# EAGLE design Power Supply (EAGLE 9.2.2)
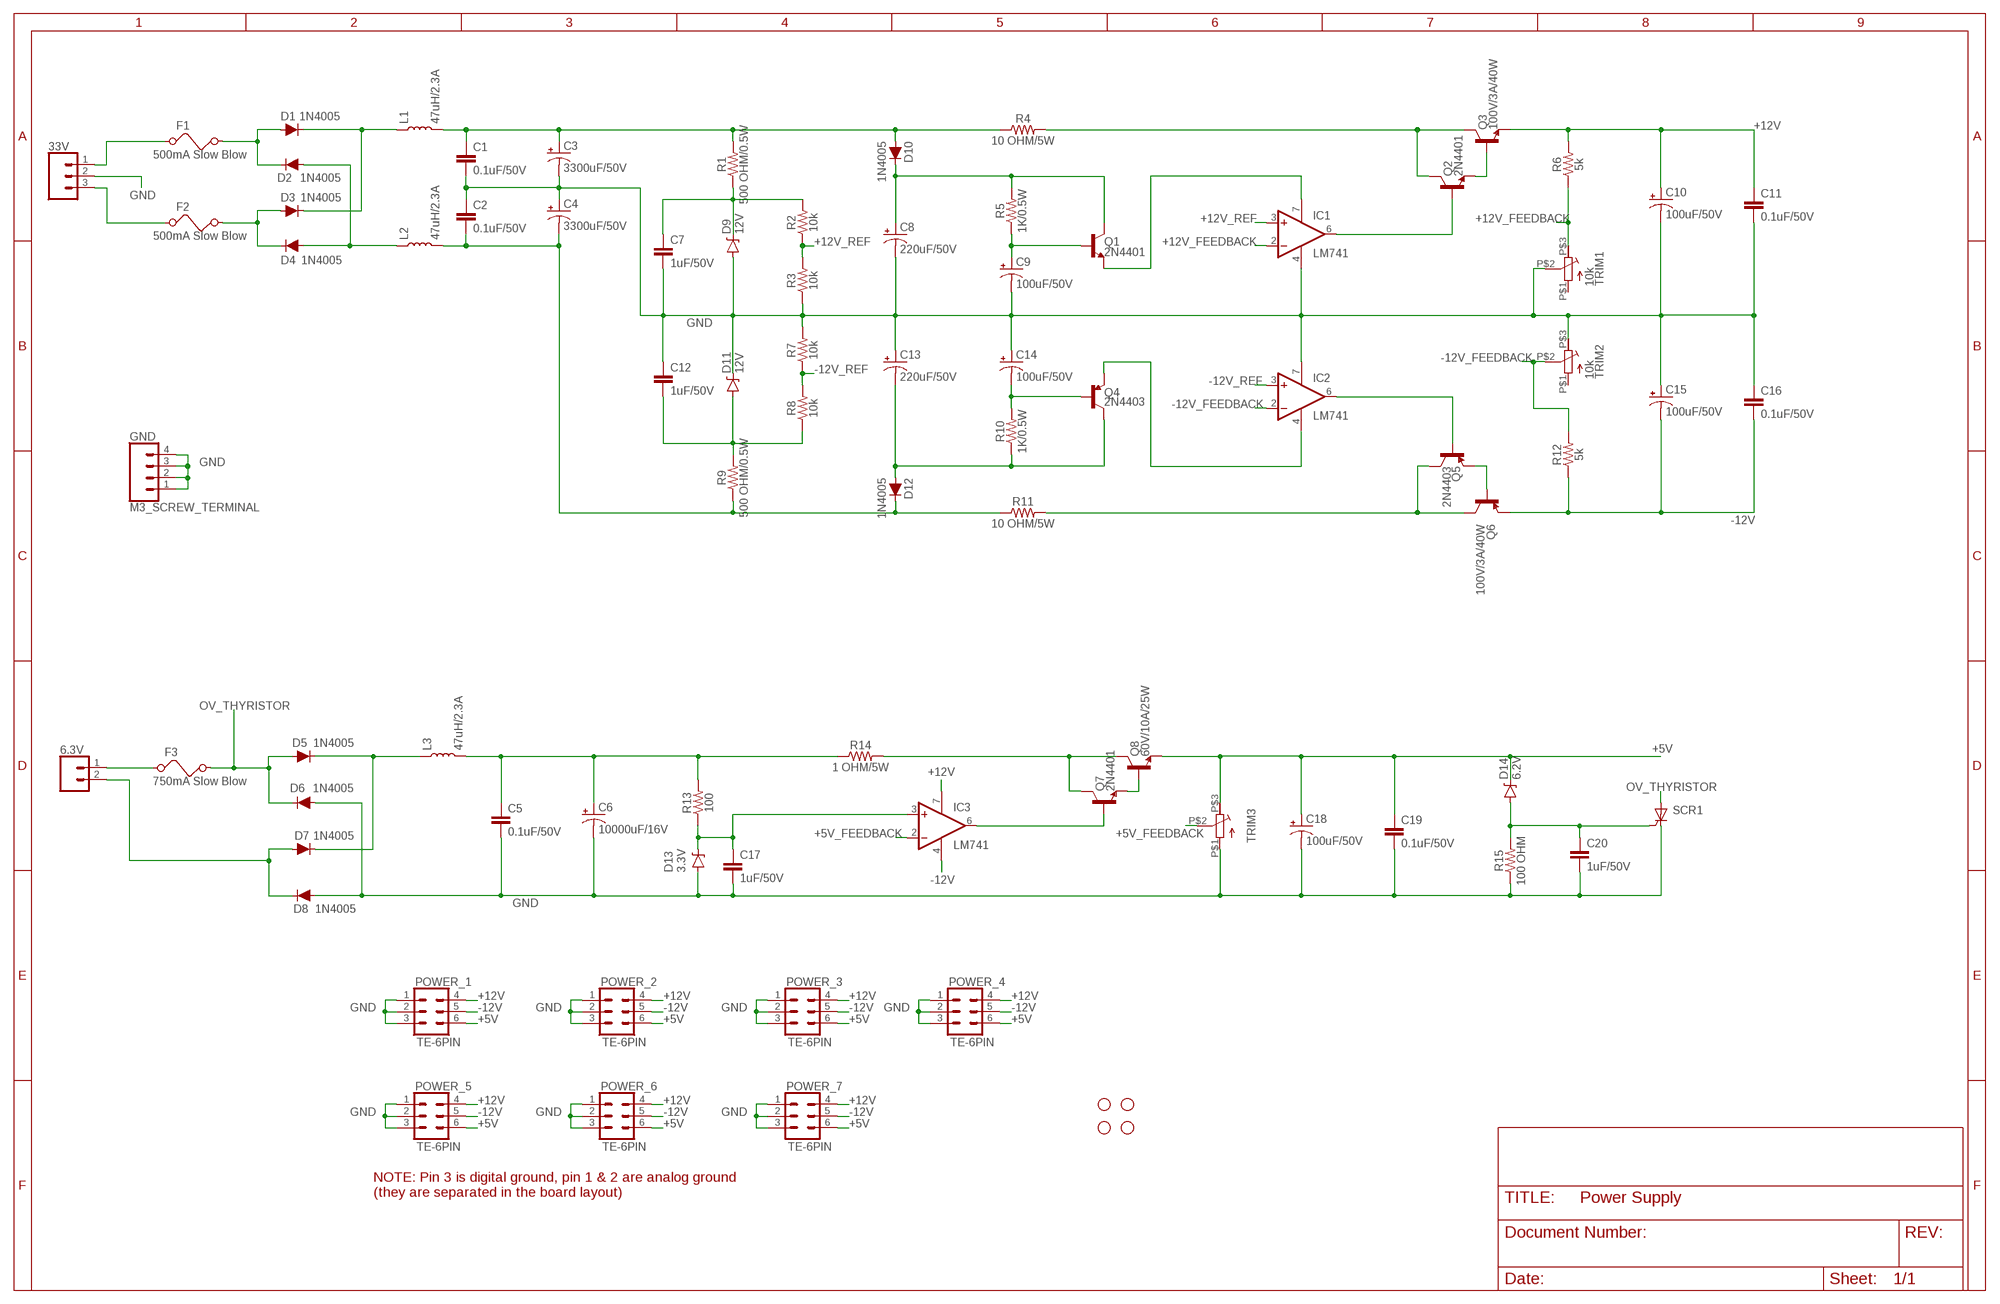
[diagram p0: schematic, sheet 1]

## Parts
6.3V  TE-2PIN  [2_PIN_CONNECT]
33V  TE-3PIN  [3_PIN_TE]
C1  0.1uF/50V  CERAMIC_CAPACITOR  [CERAMIC_CAPACITOR]
C2  0.1uF/50V  CERAMIC_CAPACITOR  [CERAMIC_CAPACITOR]
C3  3300uF/50V  3300UF_CAP  [POLARIZED_CAP_3300UF]
C4  3300uF/50V  3300UF_CAP  [POLARIZED_CAP_3300UF]
C5  0.1uF/50V  CERAMIC_CAPACITOR  [CERAMIC_CAPACITOR]
C6  10000uF/16V  3300UF_CAP  [POLARIZED_CAP_3300UF]
C7  1uF/50V  CERAMIC_CAPACITOR  [CERAMIC_CAPACITOR]
C8  220uF/50V  220UF  [220UF_CAP]
C9  100uF/50V  100UF  [100UF_CAP]
C10  100uF/50V  100UF  [100UF_CAP]
C11  0.1uF/50V  CERAMIC_CAPACITOR  [CERAMIC_CAPACITOR]
C12  1uF/50V  CERAMIC_CAPACITOR  [CERAMIC_CAPACITOR]
C13  220uF/50V  220UF  [220UF_CAP]
C14  100uF/50V  100UF  [100UF_CAP]
C15  100uF/50V  100UF  [100UF_CAP]
C16  0.1uF/50V  CERAMIC_CAPACITOR  [CERAMIC_CAPACITOR]
C17  1uF/50V  CERAMIC_CAPACITOR  [CERAMIC_CAPACITOR]
C18  100uF/50V  100UF  [100UF_CAP]
C19  0.1uF/50V  CERAMIC_CAPACITOR  [CERAMIC_CAPACITOR]
C20  1uF/50V  CERAMIC_CAPACITOR  [CERAMIC_CAPACITOR]
D1  1N4005  [DIODE-1N4001]
D2  1N4005  [DIODE-1N4001]
D3  1N4005  [DIODE-1N4001]
D4  1N4005  [DIODE-1N4001]
D5  1N4005  [DIODE-1N4001]
D6  1N4005  [DIODE-1N4001]
D7  1N4005  [DIODE-1N4001]
D8  1N4005  [DIODE-1N4001]
D9  12V  1W_ZENER  [1W_ZENER]
D10  1N4005  [DIODE-1N4001]
D11  12V  1W_ZENER  [1W_ZENER]
D12  1N4005  [DIODE-1N4001]
D13  3.3V  1W_ZENER  [1W_ZENER]
D14  6.2V  1W_ZENER  [1W_ZENER]
F1  500mA Slow Blow  FUSE  [FUSEHOLDER]
F2  500mA Slow Blow  FUSE  [FUSEHOLDER]
F3  750mA Slow Blow  FUSE  [FUSEHOLDER]
GND  M3_SCREW_TERMINAL  [M3_SCREW_TERMINAL]
H1  STAND-OFF  [STAND-OFF]
H2  STAND-OFF  [STAND-OFF]
H3  STAND-OFF  [STAND-OFF]
H4  STAND-OFF  [STAND-OFF]
IC1  LM741  [DIL08]
IC2  LM741  [DIL08]
IC3  LM741  [DIL08]
L1  47uH/2.3A  47_UH_INDUCTOR  [47UH_2.3A_COIL]
L2  47uH/2.3A  47_UH_INDUCTOR  [47UH_2.3A_COIL]
L3  47uH/2.3A  47_UH_INDUCTOR  [47UH_2.3A_COIL]
POWER_1  TE-6PIN  [TE_6_PIN]
POWER_2  TE-6PIN  [TE_6_PIN]
POWER_3  TE-6PIN  [TE_6_PIN]
POWER_4  TE-6PIN  [TE_6_PIN]
POWER_5  TE-6PIN  [TE_6_PIN]
POWER_6  TE-6PIN  [TE_6_PIN]
POWER_7  TE-6PIN  [TE_6_PIN]
Q1  2N4401  [TO-92]
Q2  2N4401  [TO-92]
Q3  100V/3A/40W  BD241C  [TO-220_LARGE_HEATSINK]
Q4  2N4403  [TO-92]
Q5  2N4403  [TO-92]
Q6  100V/3A/40W  BD242C  [TO-220_LARGE_HEATSINK]
Q7  2N4401  [TO-92]
Q8  60V/10A/25W  C6144  [TO-220_SMALL_HEATSINK]
R1  500 OHM/0.5W  0.5W_RES  [0.5W_RES]
R2  10k  0.25W_RES  [0.25W_RES]
R3  10k  0.25W_RES  [0.25W_RES]
R4  10 OHM/5W  5W_RES  [5W_RES]
R5  1K/0.5W  0.5W_RES  [0.5W_RES]
R6  5k  0.25W_RES  [0.25W_RES]
R7  10k  0.25W_RES  [0.25W_RES]
R8  10k  0.25W_RES  [0.25W_RES]
R9  500 OHM/0.5W  0.5W_RES  [0.5W_RES]
R10  1K/0.5W  0.5W_RES  [0.5W_RES]
R11  10 OHM/5W  5W_RES  [5W_RES]
R12  5k  0.25W_RES  [0.25W_RES]
R13  100  0.25W_RES  [0.25W_RES]
R14  1 OHM/5W  5W_RES  [5W_RES]
R15  100 OHM  0.25W_RES  [0.25W_RES]
SCR1  THYRISTOR_4A  [TO220V]
TRIM1  10k  10K_TRIMMER  [10K_TRIM]
TRIM2  10k  10K_TRIMMER  [10K_TRIM]
TRIM3  10K_TRIMMER  [10K_TRIM]

## Nets
+5V: C18.P1+(+) C19.P$1 D14.P$2CATHODE(C) POWER_1.6 POWER_2.6 POWER_3.6 POWER_4.6 POWER_5.6 POWER_6.6 POWER_7.6 Q8.P$3(E) TRIM3.P$3(E)
+5V_FEEDBACK: IC3.2(-IN) TRIM3.P$2(S)
+12V: C10.P1+(+) C11.P$1 IC3.7(V+) POWER_1.4 POWER_2.4 POWER_3.4 POWER_4.4 POWER_5.4 POWER_6.4 POWER_7.4 Q3.P$3(E) R6.P$2
+12V_FEEDBACK: IC1.2(-IN) R6.P$1 TRIM1.P$3(E)
+12V_REF: IC1.3(+IN) R2.P$1 R3.P$2
-12V: C15.P2-(-) C16.P$2 IC3.4(V-) POWER_1.5 POWER_2.5 POWER_3.5 POWER_4.5 POWER_5.5 POWER_6.5 POWER_7.5 Q6.P$3(E) R12.P$1
-12V_FEEDBACK: IC2.2(-IN) R12.P$2 TRIM2.P$2(S)
-12V_REF: IC2.3(+IN) R7.P$1 R8.P$2
GND: 33V.2 C1.P$2 C2.P$1 C3.P2-(-) C4.P1+(+) C5.P$2 C6.P2-(-) C7.P$2 C8.P2-(-) C9.P2-(-) C10.P2-(-) C11.P$2 C12.P$1 C13.P1+(+) C14.P1+(+) C15.P1+(+) C16.P$1 C17.P$2 C18.P2-(-) C19.P$2 C20.P$2 D6.A D8.A D9.P$1ANODE(A) D11.P$2CATHODE(C) D13.P$1ANODE(A) GND.1 GND.2 GND.3 GND.4 IC1.4(V-) IC2.7(V+) POWER_1.1 POWER_1.2 POWER_1.3 POWER_2.1 POWER_2.2 POWER_2.3 POWER_3.1 POWER_3.2 POWER_3.3 POWER_4.1 POWER_4.2 POWER_4.3 POWER_5.1 POWER_5.2 POWER_5.3 POWER_6.1 POWER_6.2 POWER_6.3 POWER_7.1 POWER_7.2 POWER_7.3 R3.P$1 R7.P$2 R15.P$1 SCR1.1(C) TRIM1.P$2(S) TRIM2.P$3(E) TRIM3.P$1(A)
N$1: D1.C D3.C L1.P$1
N$2: D1.A D2.C F1.P$2
N$3: D3.A D4.C F2.P$2
N$4: D2.A D4.A L2.P$1
N$5: 33V.1 F1.P$1
N$6: 33V.3 F2.P$1
N$7: C1.P$1 C3.P1+(+) D10.A L1.P$2 R1.P$2 R4.P$1
N$8: C8.P1+(+) D10.C Q1.3(C) R5.P$2
N$9: C2.P$2 C4.P2-(-) D12.C L2.P$2 R9.P$1 R11.P$1
N$10: C9.P1+(+) Q1.2(B) R5.P$1
N$11: IC1.7(V+) Q1.1(E)
N$12: Q2.3(C) Q3.P$2(C) R4.P$2
N$13: Q2.1(E) Q3.P$1(B)
N$14: IC1.6(OUT) Q2.2(B)
N$15: C7.P$1 D9.P$2CATHODE(C) R1.P$1 R2.P$2
N$16: C13.P2-(-) D12.A Q4.3(C) R10.P$1
N$17: C17.P$1 D13.P$2CATHODE(C) IC3.3(+IN) R13.P$1
N$18: C12.P$2 D11.P$1ANODE(A) R8.P$1 R9.P$2
N$19: 6.3V.1 F3.P$1
N$20: C14.P2-(-) Q4.2(B) R10.P$2
N$21: IC2.4(V-) Q4.1(E)
N$23: Q5.3(C) Q6.P$2(C) R11.P$2
N$24: Q5.1(E) Q6.P$1(B)
N$25: IC2.6(OUT) Q5.2(B)
N$26: Q7.3(C) Q8.P$2(C) R14.P$2
N$27: 6.3V.2 D7.A D8.C
N$28: IC3.6(OUT) Q7.2(B)
N$29: D5.C D7.C L3.P$1
N$30: C5.P$1 C6.P1+(+) L3.P$2 R13.P$2 R14.P$1
N$32: Q7.1(E) Q8.P$1(B)
N$33: C20.P$1 D14.P$1ANODE(A) R15.P$2 SCR1.3(G)
OV_THYRISTOR: D5.A D6.C F3.P$2 SCR1.2(A)
Unconnected: TRIM1.P$1(A) TRIM2.P$1(A)

## Notes on the sheet
- NOTE: Pin 3 is digital ground, pin 1 & 2 are analog ground 
  (they are separated in the board layout)

## Library data of the parts
6.3V = Capstone:TE-2PIN
33V = Capstone:TE-3PIN
C1 C2 C5 C7 C11 C12 C16 C17 C19 C20 = Capstone:CERAMIC_CAPACITOR
C3 C4 C6 = Capstone:3300UF_CAP
C8 C13 = Capstone:220UF
C9 C10 C14 C15 C18 = Capstone:100UF
D1-D8 D10 D12 = Capstone:1N4005
D9 D11 D13 D14 = Capstone:1W_ZENER
F1-F3 = Capstone:FUSE
GND = EcoCar Temp:M3_SCREW_TERMINAL
H1-H4 = SparkFun-Hardware:STAND-OFF: Stand Off Drill holes for mechanically mounting via screws, standoffs, etc. Note: Use the keepout ring to avoid running the screw head into surrounding components. Variant Overviews STAND-OFF - Mechanical footprint for a #4 phillips button head screw. STAND-OFF-TIGHT - Mechanical footprint for a #4 phillips button head screw, Example SparkFun Products Screw - Phillips Head (1/4", 4-40, 10 pack) <https://www.sparkfun.com/products/10453> (PRT-10453) Screw - Phillips Head (1/2", 4-40, 10 pack) <https://www.sparkfun.com/products/10452> (PRT-10452) Screw - Phillips Head (3/4", 4-40, 10 pack) <https://www.sparkfun.com/products/10451> (PRT-10451) Screw - Phillips Head (1", 4-40, 10 pack) <https://www.sparkfun.com/products/10450> (PRT-10450)
IC1-IC3 = Capstone:LM741
L1-L3 = Capstone:47_UH_INDUCTOR
POWER_1-POWER_7 = Capstone:TE-6PIN
Q1 Q2 Q7 = Capstone:2N4401
Q3 = Capstone:BD241C
Q4 Q5 = Capstone:2N4403
Q6 = Capstone:BD242C
Q8 = Capstone:C6144
R1 R5 R9 R10 = Capstone:0.5W_RES
R2 R3 R6-R8 R12 R13 R15 = Capstone:0.25W_RES
R4 R11 R14 = Capstone:5W_RES
SCR1 = Capstone:THYRISTOR_4A
TRIM1-TRIM3 = Capstone:10K_TRIMMER

## Board
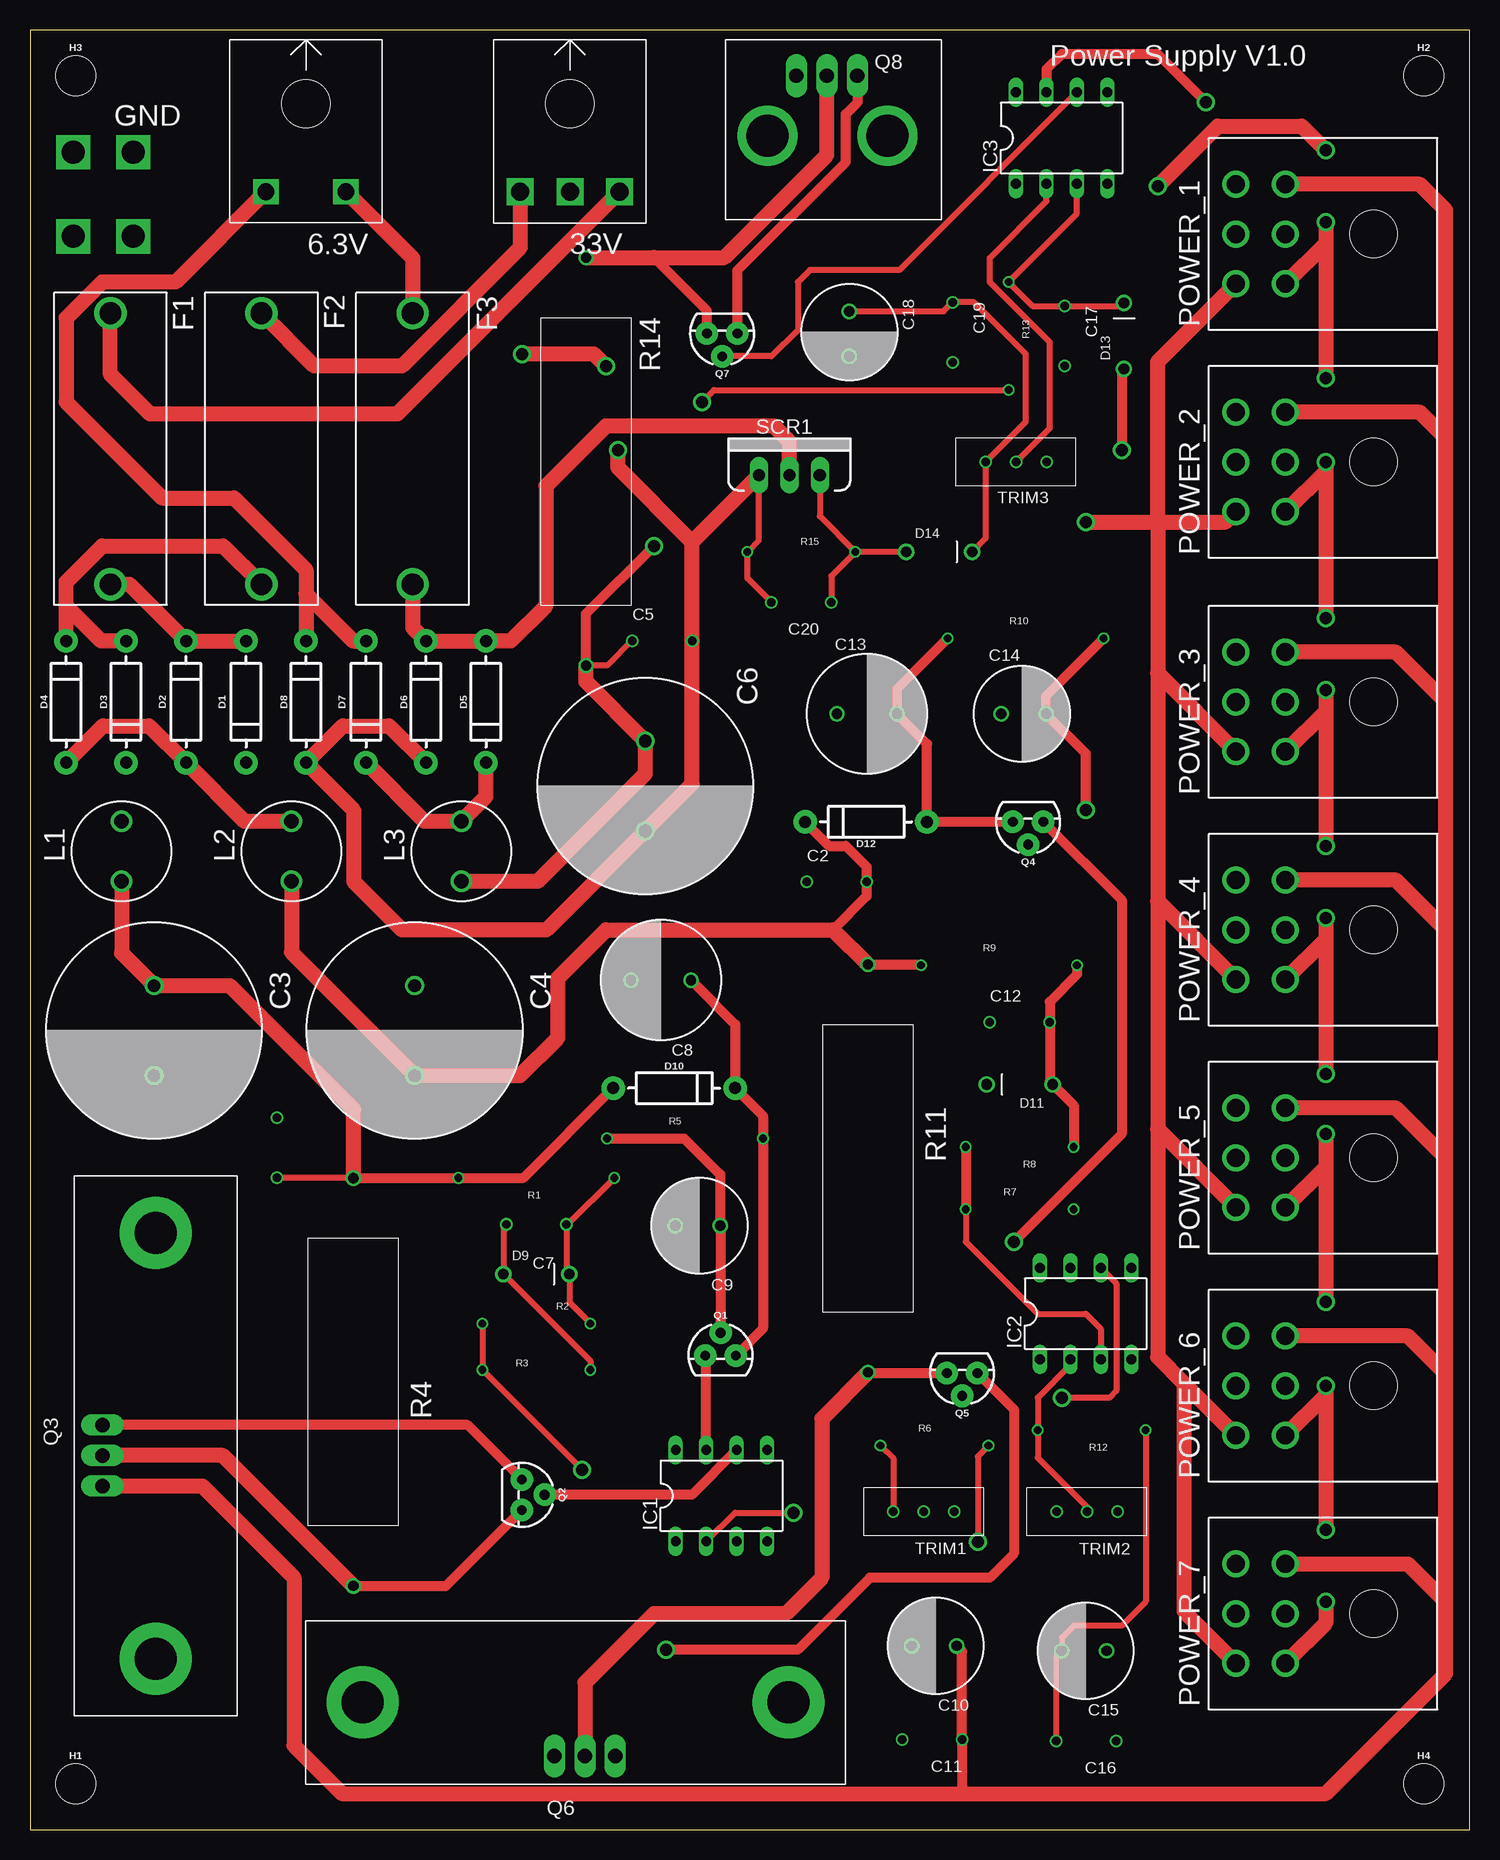
[diagram p1: board, top side]
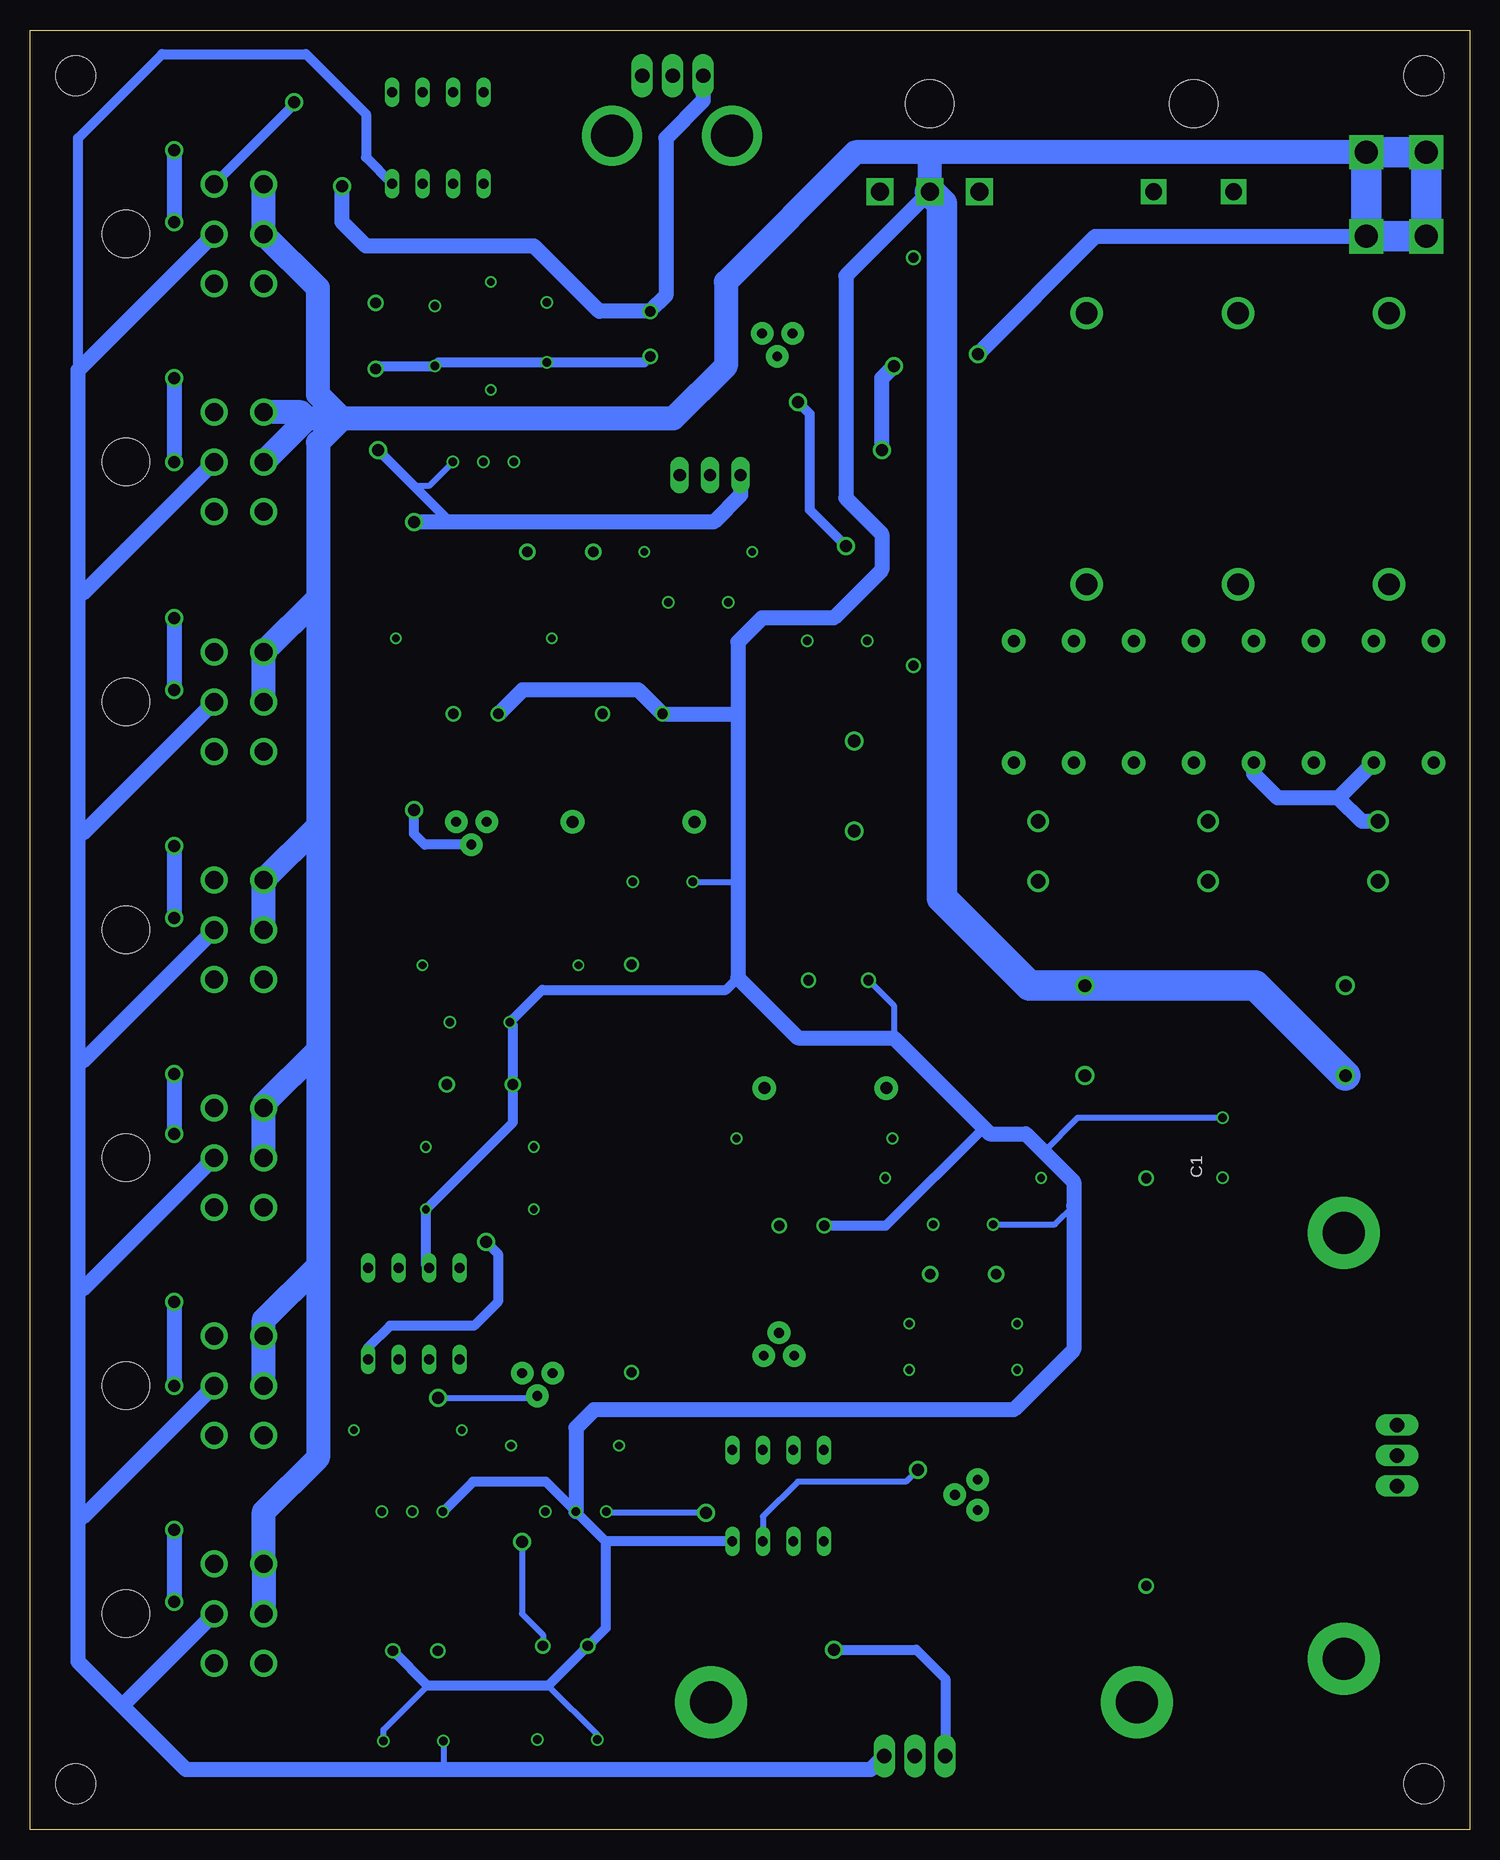
[diagram p2: board, bottom side, seen from below]

Size 120 x 150 mm. Coordinates in mm from the lower left corner, seen from the top.
Outline: 0,0 120,0 120,150 0,150 0,0
Copper layers (1*16): Top 0.035mm / dielectric 1.5mm / Bottom 0.035mm
Design rules "JLCPCB2Layer": minimum track width 6mil, minimum drill 10mil, track to track 6mil, track to pad 6mil, pad to pad 6mil, via to via 6mil, smd to smd 0mil, copper to edge 10mil, drill to drill 10mil, minimum pad ring 6mil, minimum via ring 6mil, stop-mask expansion 2mil, vias tented up to drill 100mil, thermal gap 10mil

### Footprints (pad centres in the part's own frame; a part is rotated, then mirrored left to right if it is on the bottom)
2_PIN_CONNECT = drill 1.4 square: 1 -3.34,12.67; 2 3.34,12.67 | hole 4: 0,5.33
3_PIN_TE = drill 1.5 square: 1 -4.14,12.67; 2 0,12.67; 3 4.14,12.67 | hole 4: 0,5.33
CERAMIC_CAPACITOR = drill 0.7: P$1 -2.5,0; P$2 2.5,0
POLARIZED_CAP_3300UF = drill 1.05: P1+ -3.75,0; P2- 3.75,0
220UF_CAP = drill 0.85: P1+ -2.5,0; P2- 2.5,0
100UF_CAP = drill 0.85: P1+ -1.75,0; P2- 2,0
DIODE-1N4001 = drill 1 pad 1.981: A -5.08,0; C 5.08,0
1W_ZENER = drill 0.9: P$1ANODE -2.75,0; P$2CATHODE 2.75,0
FUSEHOLDER = drill 1.8: P$1 1.7,4.7; P$2 24.3,4.7
M3_SCREW_TERMINAL = drill 1.9 square: 1 0,0; 2 0,7.01; 3 5,7.01; 4 5,0
STAND-OFF = hole 3.302: 0,0
DIL08 = drill 0.813 long: 1 -3.81,-3.81; 2 -1.27,-3.81; 3 1.27,-3.81; 4 3.81,-3.81; 5 3.81,3.81; 6 1.27,3.81; 7 -1.27,3.81; 8 -3.81,3.81
47UH_2.3A_COIL = drill 1.2: P$1 -2.5,0; P$2 2.5,0
TE_6_PIN = drill 1.5: 1 4.14,11.48; 2 0,11.48; 3 -4.14,11.48; 4 4.14,7.34; 5 0,7.34; 6 -4.14,7.34 | hole 3.91: 0,0
TO-92 = drill 0.813 pad 1.88: 1 -1.27,0; 2 0,1.905; 3 1.27,0
TO-220_LARGE_HEATSINK = drill 1.2 long: P$1 20.75,2.35; P$2 23.29,2.35; P$3 25.83,2.35 | drill 3.5 pad 6: P$4 4.75,6.8; P$5 40.25,6.8
TO-220_SMALL_HEATSINK = drill 1.2 long: P$1 7,3; P$2 9.54,3; P$3 12.08,3 | drill 3.5 pad 5: P$4 4.5,8; P$5 14.5,8
0.5W_RES = drill 0.65: P$1 -6.5,0; P$2 6.5,0
0.25W_RES = drill 0.65: P$1 -4.5,0; P$2 4.5,0
5W_RES = drill 0.85: P$1 -5,3.75; P$2 29,3.75
TO220V = drill 1.016 long: 1 -2.54,0; 2 0,0; 3 2.54,0
10K_TRIM = drill 0.7: P$1 2.46,2; P$2 5,2; P$3 7.54,2

### Placement (x,y rotation side)
6.3V  23,149.19 180 top
33V  45,149.19 180 top
C1  20.57,56.82 90 bottom
C2  67.25,78.99 0 top
C3  10.34,66.6 270 top
C4  32.06,66.6 270 top
C5  52.7,99.1 0 top
C6  51.29,86.98 270 top
C7  42.21,50.44 180 top
C8  52.6,70.8 180 top
C9  55.8,50.34 180 top
C10  75.5,15.3 180 top
C11  75.2,7.5 180 top
C12  82.5,67.3 0 top
C13  69.77,93 0 top
C14  82.7,93 0 top
C15  88,14.9 180 top
C16  88.03,7.37 180 top
C17  86.26,124.5 270 top
C18  68.3,124.8 270 top
C19  76.9,124.8 270 top
C20  64.3,102.3 180 top
D1  18,94 270 top
D2  13,94 90 top
D3  8,94 270 top
D4  3,94 90 top
D5  38,94 270 top
D6  33,94 90 top
D7  28,94 270 top
D8  23,94 90 top
D9  42.21,46.29 0 top
D10  53.7,61.8 0 top
D11  82.5,62.1 180 top
D12  69.7,84 180 top
D13  91.2,124.5 90 top
D14  75.8,106.5 0 top
F1  2,128.1 270 top
F2  14.6,128.1 270 top
F3  27.2,128.1 270 top
GND  3.6,132.8 0 top
H1  3.81,3.81 0 top
H2  116.19,146.19 0 top
H3  3.81,146.19 0 top
H4  116.19,3.81 0 top
IC1  57.64,27.83 0 top
IC2  88,43 0 top
IC3  86,141 0 top
L1  7.64,81.55 270 top
L2  21.8,81.55 270 top
L3  35.96,81.55 270 top
POWER_1  112,133 90 top
POWER_2  112,114 90 top
POWER_3  112,94 90 top
POWER_4  112,75 90 top
POWER_5  112,56 90 top
POWER_6  112,37 90 top
POWER_7  112,18 90 top
Q1  57.56,39.5 0 top
Q2  41,27.9 270 top
Q3  3.69,54.46 270 top
Q4  83.2,84 180 top
Q5  77.7,38.05 180 top
Q6  22.96,3.79 0 top
Q7  57.7,124.7 180 top
Q8  75.96,149.19 180 top
R1  42.21,54.32 180 top
R2  42.21,42.17 0 top
R3  42.21,38.32 180 top
R4  23.2,49.3 270 top
R5  54.6,57.6 0 top
R6  75.4,32 0 top
R7  82.5,51.7 0 top
R8  82.5,56.9 180 top
R9  80.78,72.05 0 top
R10  83,99.3 0 top
R11  66.1,67.1 270 top
R12  88.5,33.3 180 top
R13  81.58,124.5 270 top
R14  50.1,102.03 90 top
R15  64.3,106.5 180 bottom
SCR1  63.3,112.89 0 top
TRIM1  79.5,28.5 180 top
TRIM2  93.12,28.5 180 top
TRIM3  87.2,116 180 top

### Tracks (layer width: path | path; a pad name or v marks a point on that pad's centre or on a via)
+5V  (via drill 1)
  Top 0.508: D14.P$2CATHODE 79.66,107.61 TRIM3.P$3 83,117.34 83,123 78.7,127.3 C19.P$1 76.15,126.55 C18.P1+
  Top 1.27: v94,137 99,142 106,142 v108,140 | v108,134 108,132.2 | 108,132.2 POWER_1.6 | v108,114 108,113.2 | 108,113.2 POWER_2.6 | 108,132.2 v108,121 | 108,113.2 v108,101 | v108,95 108,93.2 | 108,93.2 POWER_3.6 | 108,93.2 v108,82 | v108,76 108,74.2 | 108,74.2 POWER_4.6 | 108,74.2 v108,63 | v108,58 108,55.2 | 108,55.2 POWER_5.6 | 108,55.2 v108,44 | v108,37 108,36.2 | 108,36.2 POWER_6.6 | 108,36.2 v108,25 | v108,19 108,17.2 POWER_7.6
  Bottom 1.27: Q8.P$3 63.88,144.12 67,141 67,127.85 C18.P1+ 72.55,126.55 78,132 92,132 94,134 v94,137 | v108,140 v108,134 | v108,121 v108,114 | v108,101 v108,95 | v108,82 v108,76 | v108,63 v108,58 | v108,44 v108,37 | v108,25 v108,19
+5V_FEEDBACK
  Top 0.508: TRIM3.P$2 85,116.8 85,124 80,129 80,131 84.73,135.73 IC3.2
+12V  (via drill 1)
  Top 0.508: R6.P$2 79,31.1 v79,24
  Top 0.813: C10.P1+ 77.7,14.85 C11.P$1 77.7,3.3 78,3 | v98,144 94,148 86,148 84.73,146.73 IC3.7
  Top 1.27: Q3.P$3 14.37,28.63 22,21 22,7 26,3 78,3 108,3 118,13 118,19 | 118,19 118,38 | 118,38 118,56 | 118,56 118,75 | 118,75 118,94 | 118,94 118,116 | POWER_7.4 114.86,22.14 118,19 | 118,38 114.86,41.14 POWER_6.4 | 118,56 113.86,60.14 POWER_5.4 | 118,75 113.86,79.14 POWER_4.4 | 118,94 113.86,98.14 POWER_3.4 | 118,116 115.86,118.14 POWER_2.4 | POWER_1.4 115.86,137.14 118,135 118,116
  Bottom 0.508: v79,24 79,18 77.25,16.25 C10.P1+
  Bottom 0.813: POWER_1.4 98,143.8 v98,144
+12V_FEEDBACK  (via drill 1)
  Top 0.508: R6.P$1 71.96,30.94 TRIM1.P$3 | IC1.2 58.77,26.42 v63.63,26.42
  Bottom 0.508: v63.63,26.42 71.88,26.42 TRIM1.P$3
+12V_REF  (via drill 1)
  Top 0.508: R2.P$1 R3.P$2 46,30.03 v46,30
  Bottom 0.508: v46,30 47,29 56,29 58.91,26.09 IC1.3
-12V
  Top 0.508: C16.P$2 85.53,14.44 C15.P2- 86,16 87,17 91,17 93,19 R12.P$1
  Bottom 0.508: C16.P$2 85.53,5.46 86,5
  Bottom 0.813: 116,121.66 116,141 109,148 97,148 92,143 92,139.38 IC3.4
  Bottom 1.27: Q6.P$3 49.93,5 86,5 107,5 112.5,10.5 | 116,26 116,14 112.5,10.5 | 116,26 116,45 | 116,45 116,64 | 116,64 116,83 | 116,83 116,103 | 116,103 116,121.66 POWER_1.5 | POWER_2.5 115.66,103 116,103 | POWER_3.5 115.66,83 116,83 | POWER_4.5 115.66,64 116,64 | POWER_5.5 115.66,45 116,45 | POWER_6.5 115.66,26 116,26 | POWER_7.5 112.16,10.5 112.5,10.5
-12V_FEEDBACK
  Top 0.508: IC2.2 86.73,38.73 84,36 R12.P$2 84,31 88.12,26.88 TRIM2.P$2
-12V_REF
  Top 0.508: R7.P$1 78,49 84,43 88,43 89.27,41.73 IC2.3
  Top 0.813: R8.P$2 R7.P$1
GND  (via drill 1)
  Top 0.508: C20.P$2 59.8,104.3 R15.P$1 60.76,107.46 SCR1.1 | C7.P$2 39.46,50.19 D9.P$1ANODE 46.71,39.04 R3.P$1
  Top 0.813: D13.P$1ANODE 91,121.55 v91,115
  Top 1.27: D6.A 29.92,92 26.08,92 D8.A 27,84.92 27,79 31,75 43.06,75 C6.P2- 55.2,87.14 C5.P$2 55.2,107.33 | 55.2,107.33 SCR1.1 | v88,109 94,109 | 94,109 99.66,109 POWER_2.3 | 94,109 94,96.38 | 94,96.38 POWER_3.3 | 94,96.38 94,77.38 | 94,77.38 POWER_4.3 | 94,77.38 94,58.38 | 94,58.38 POWER_5.3 | 94,58.38 94,39.38 96.19,37.19 | 96.19,37.19 POWER_6.3 | 96.19,37.19 96.19,18.19 POWER_7.3 | 94,109 94,122.34 POWER_1.3 | 55.2,107.33 49,113.53 v49,115 | v48,122 47,123 v41,123
  Bottom 0.508: D13.P$1ANODE 90.95,122 | C17.P$2 85.96,122.3 | 68.8,122.3 C18.P2- | TRIM3.P$1 86.74,112 88,112 | C2.P$1 64.74,79 61,79 | C11.P$2 72.7,7.9 76.8,12 | C16.P$1 90.53,8.31 86.85,12 | C7.P$2 34.56,50.44 33,52 | C1.P$2 32.68,59.32 35.5,56.5 | C8.P2- 48,68.7 48,66
  Bottom 0.813: 90.95,122 C17.P$2 | 85.96,122.3 C19.P$2 68.8,122.3 | v91,115 88,112 85,109 | IC2.7 87,47.08 R7.P$2 79.75,58.95 D11.P$2CATHODE 79.75,67.05 C12.P$1 77.3,70 62,70 61,71 | IC1.4 72.02,24.02 | 72.02,24.02 TRIM1.P$2 77,29 83.08,29 TRIM2.P$3 | 72.02,24.02 72.02,16.78 C10.P2- 76.8,12 86.85,12 C15.P1+ | C9.P2- 48.66,50.34 40.5,58.5
  Bottom 1.27: SCR1.1 60.76,111.24 63,109 85,109 v88,109 | v49,115 49,121 v48,122 | v41,123 31.2,132.8 GND.4 | 33V.2 52,129.52 52,111 49,108 49,105 53,101 59,101 61,99 61,93 | 61,93 61,79 61,71 56,66 48,66 40.5,58.5 40,58 37,58 35.5,56.5 33,54 33,52 33,40 38,35 73,35 74.5,33.5 TRIM1.P$2 | 61,93 C13.P1+ 69.27,95 78.95,95 C14.P1+
  Bottom 2: GND.3 45,139.81 | 94,117.62 66.38,117.62 62,122 62,129 51.19,139.81 45,139.81 | 33V.2 45,139.81 | 94,117.62 96,115.62 96,102.66 | 96,102.66 96,83.66 | 96,83.66 96,65 | 96,65 96,47 | 96,47 96,31 100.52,26.48 POWER_7.1 POWER_7.2 | POWER_6.2 POWER_6.1 100.52,42.48 96,47 | POWER_5.2 POWER_5.1 100.52,60.48 96,65 | POWER_4.2 POWER_4.1 96,83.66 | POWER_3.2 POWER_3.1 96,102.66 | 94,117.62 96,119.62 96,128.48 POWER_1.2 POWER_1.1 | 94,117.62 96.9,117.62 | 96.9,117.62 POWER_2.2 | 96.9,117.62 97.42,118.14 POWER_2.1
  Bottom 2.54: 33V.2 44,135.52 44,77.66 36.7,70.35 C4.P1+ 17.84,70.35 C3.P2- | GND.2 GND.3 GND.4 GND.1 GND.2
N$1
  Bottom 1.27: D3.C 10.92,86 | 10.92,86 16,86 18,88 D1.C | 10.92,86 8.97,84.05 L1.P$1
N$2
  Top 1.27: F1.P$2 8.28,103.8 D2.C D1.A
N$3
  Top 1.27: D4.C 3,102 | 3,102 3,104 6,107 16.1,107 F2.P$2 | D3.A 5.92,99.08 3,102
N$4
  Top 1.27: D4.A 6.08,92 9.92,92 D2.A 17.87,84.05 L2.P$1
N$5
  Top 1.27: F1.P$1 6.7,121.3 10,118 30.62,118 33V.1
N$6
  Top 1.27: 33V.3 40.86,131.86 31,122 23.7,122 F2.P$1
N$7
  Top 0.508: 35.69,54.3 R1.P$2 | R4.P$1 20.59,54.3 C1.P$1
  Top 0.813: R4.P$1 35.69,54.3 | R1.P$2 41.14,54.32 D10.A
  Top 1.27: R4.P$1 26.95,59.95 27,60 16.65,70.35 C3.P1+ 7.64,73.05 L1.P$2
N$8
  Top 0.813: Q1.3 61.1,41.77 R5.P$2 61.1,59.48 D10.C 58.78,67.12 C8.P1+
N$9
  Top 0.813: D12.C 66.62,82 68,82 69.75,80.25 C2.P$2 69.75,77.8 66.95,75 | R11.P$1 74.23,72.1 R9.P$1
  Top 1.27: L2.P$2 21.8,73.11 C4.P2- 40.85,62.85 44,66 44,71 48,75 66.95,75 R11.P$1
N$10
  Top 0.813: R5.P$1 54.54,57.6 57.53,54.61 57.53,50.35 C9.P1+ Q1.2
N$11
  Top 0.813: Q1.1 56.3,31.71 IC1.7
N$12
  Top 0.813: R4.P$2 34.67,20.3 Q2.3
  Top 1.27: R4.P$2 16.08,31.17 Q3.P$2
N$13
  Top 0.813: Q2.1 36.46,33.71 Q3.P$1
N$14
  Top 0.813: IC1.6 55.18,27.9 Q2.2
N$15
  Top 0.508: R1.P$1 44.83,50.44 C7.P$1 44.71,46.54 D9.P$2CATHODE 44.96,43.92 R2.P$2
N$16
  Top 0.813: Q4.3 D12.A 74.78,90.49 C13.P2- 72.27,95.07 R10.P$1
N$17
  Top 0.508: D13.P$2CATHODE 90.95,127 C17.P$1 83.58,127 R13.P$1 87.27,134.69 IC3.3
N$18
  Top 0.813: R9.P$2 87.28,71.28 85,69 C12.P$2 85,62.35 D11.P$1ANODE 87,60.35 R8.P$1
N$19
  Top 1.27: 6.3V.1 31.9,130.96 F3.P$1
N$20  (via drill 1)
  Top 0.813: v88,85 88,89.7 C14.P2- 84.7,94.5 R10.P$2
  Bottom 0.813: Q4.2 87.09,82.09 88,83 v88,85
N$21  (via drill 1)
  Top 0.813: Q4.1 91,77.47 91,58 v82,49
  Bottom 0.813: v82,49 81,48 81,44 83,42 90,42 91.81,40.19 IC2.4
N$23
  Top 0.813: R11.P$2 69.9,38.05 Q5.3
  Top 1.27: R11.P$2 66,34.25 66,21 63,18 52,18 46.25,12.25 Q6.P$2
N$24  (via drill 1)
  Top 0.813: Q5.1 82,35.02 82,23 80,21 70,21 64,15 v53,15
  Bottom 0.813: v53,15 46.12,15 43.69,12.57 43.69,6.16 Q6.P$1
N$25  (via drill 1)
  Top 0.508: IC2.6 90.55,45.53 90.55,36.55 90,36 v86,36
  Bottom 0.508: v86,36 77.85,36 Q5.2
N$26
  Top 0.813: Q7.3 56.43,126.6 52,131.03
  Top 1.27: R14.P$2 52,131.03 57.88,131.03 66.42,139.57 Q8.P$2
N$27
  Top 1.27: 6.3V.2 12.14,129 6,129 3,126 3,119 11,111 17,111 23,105 23,103 | 23,103 D8.C | 23,103 26.92,99.08 D7.A
N$28
  Top 0.508: IC3.6 72.46,130 65,130 64,129 64,125 61.8,122.8 Q7.2
N$29
  Top 1.27: D7.C 32.87,84.05 L3.P$1 38,86.09 D5.C
N$30  (via drill 1)
  Top 0.508: C5.P$1 48.13,97.03 R14.P$1 | v56,119 57,120 R13.P$2
  Top 0.813: R14.P$1 46.35,101.35 v52,107
  Top 1.27: L3.P$2 42.35,79.05 51.31,88.01 51.31,90.71 C6.P1+ 46.35,95.67 R14.P$1
  Bottom 0.813: v52,107 55,110 55,118 v56,119
N$32
  Top 0.813: Q7.1 58.97,129.97 68,139 68,143 69,144 69,146.15 Q8.P$1
N$33
  Top 0.508: D14.P$1ANODE R15.P$2 | SCR1.3 65.84,109.46 R15.P$2 | R15.P$2 66.8,104.5 C20.P$1
OV_THYRISTOR
  Top 1.27: F3.P$2 31.9,100.18 D6.C D5.A 40.08,99.08 43,102 43,112 48,117 62,117 63.3,115.7 SCR1.2

### Text on the board
tPlace: Power Supply V1.0 | GND